# EAGLE design LED_Slave_Board (EAGLE 6.5.0)
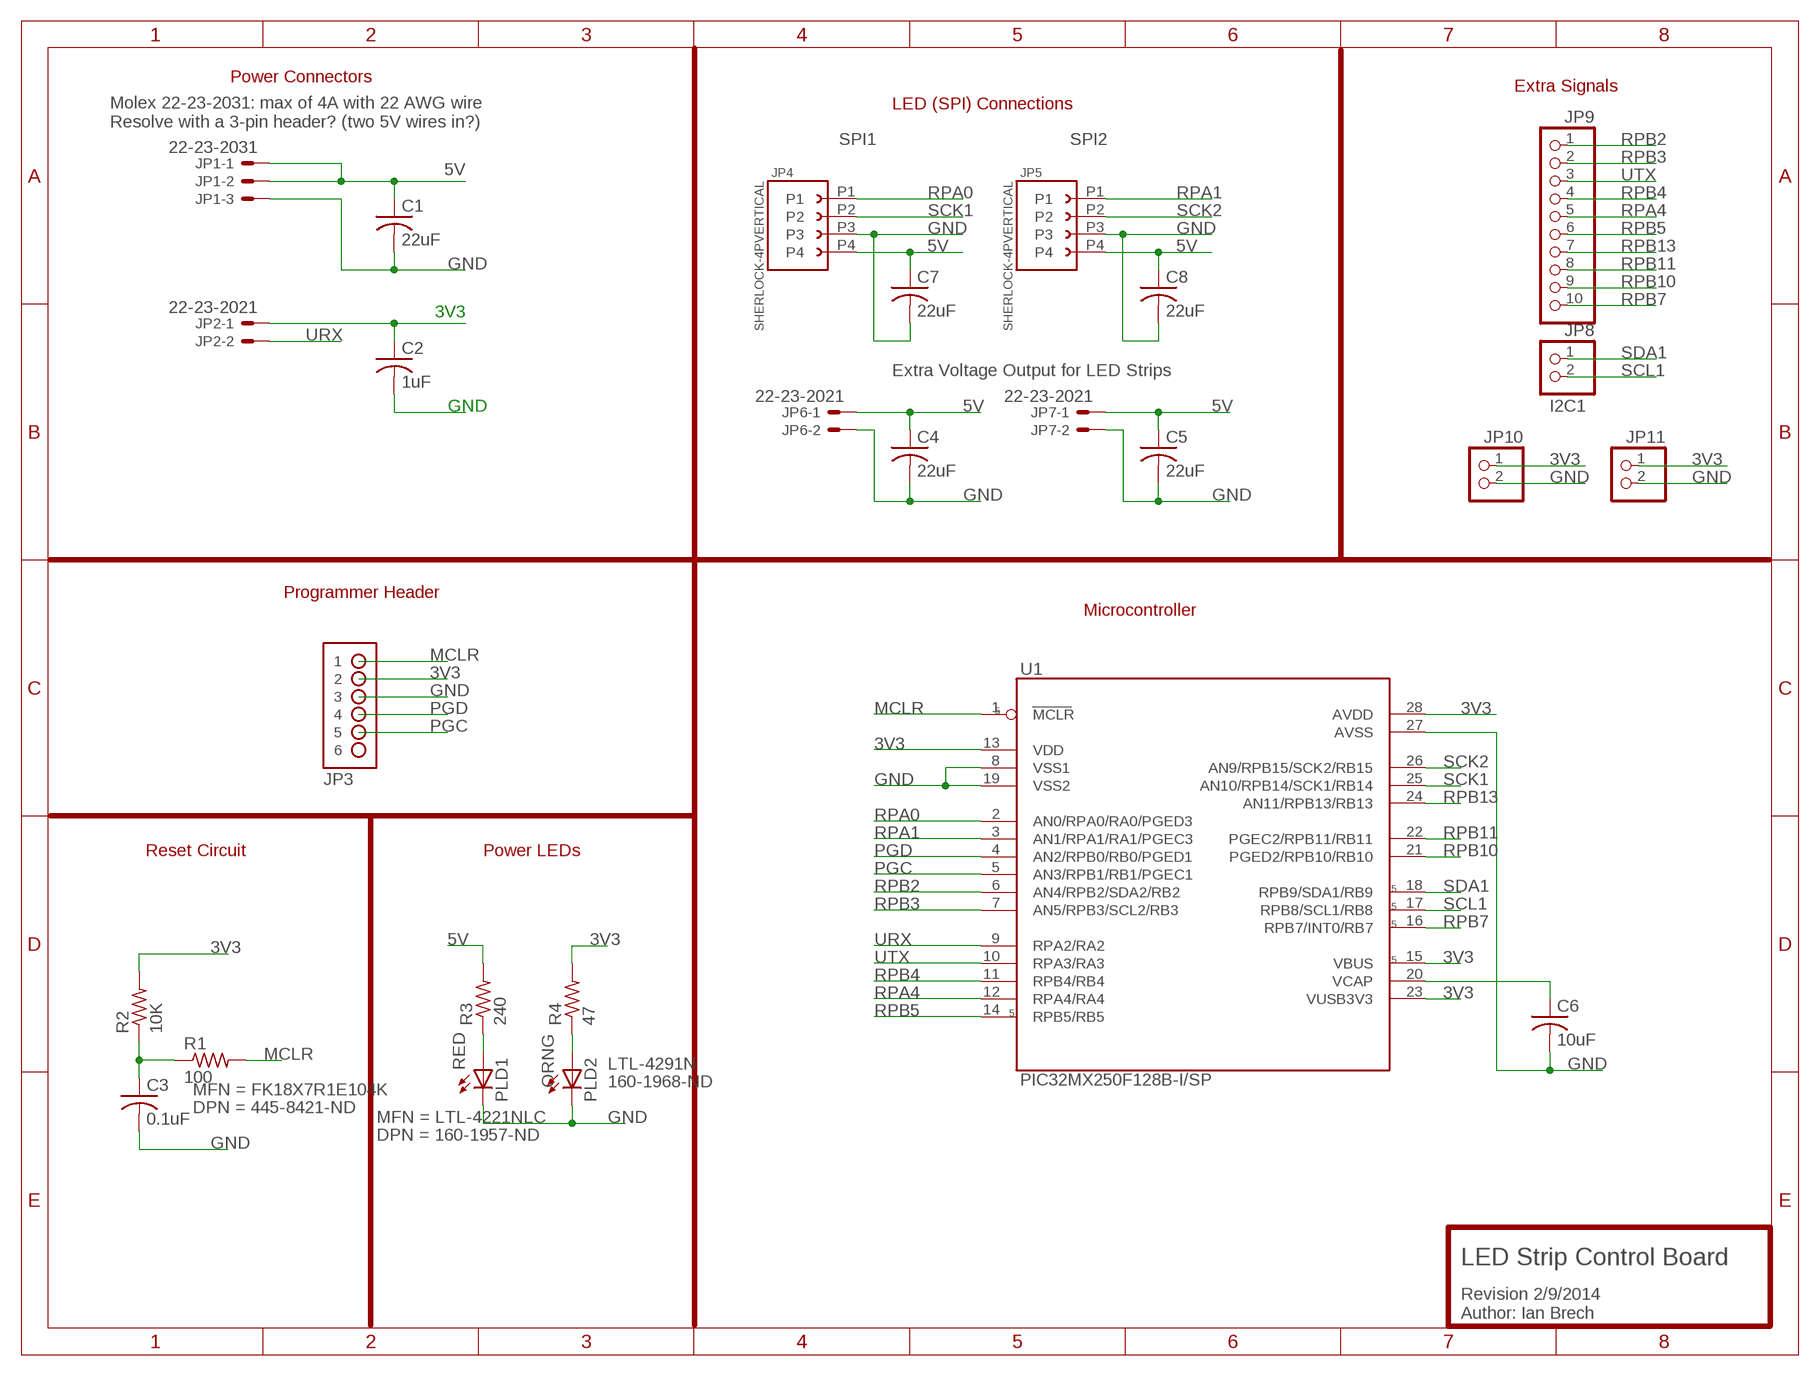
[diagram p0: schematic, sheet 1]

## Parts
C1  22uF  C-US050-045X075  [C050-045X075]
C2  1uF  C-US025-024X044  [C025-024X044]
C3  0.1uF  C-US025-040X050  [C025-040X050]
C4  22uF  C-US050-045X075  [C050-045X075]
C5  22uF  C-US050-045X075  [C050-045X075]
C6  10uF  C-US025-040X050  [C025-040X050]
C7  22uF  C-US050-045X075  [C050-045X075]
C8  22uF  C-US050-045X075  [C050-045X075]
JP1  22-23-2031  [22-23-2031]
JP2  22-23-2021  [22-23-2021]
JP3  HDR-1X6-OFFSET  [HDR-1X6_OFFSET]
JP4  SHERLOCK-4PVERTICAL  [35362-04**]
JP5  SHERLOCK-4PVERTICAL  [35362-04**]
JP6  22-23-2021  [22-23-2021]
JP7  22-23-2021  [22-23-2021]
JP8  PINHD-1X2  [1X02]
JP9  PINHD-1X10  [1X10]
JP10  PINHD-1X2  [1X02]
JP11  PINHD-1X2  [1X02]
PLD1  LED3MM  [LED3MM]
PLD2  LED3MM  [LED3MM]
R1  100  R-US_0204/7  [0204/7]
R2  10K  R-US_0204/7  [0204/7]
R3  240  R-US_0204/7  [0204/7]
R4  47  R-US_0204/7  [0204/7]
U1  PIC32MX250F128B-I/SP  [DIP254P762X508-28]

## Nets
3V3: C2.1 JP2.1 JP3.2 JP10.1 JP11.1 R2.2 R4.2 U1.13(VDD) U1.15(VBUS) U1.23(VUSB3V3) U1.28(AVDD)
5V: C1.1 C4.1 C5.1 C7.1 C8.1 JP1.1 JP1.2 JP4.P4 JP5.P4 JP6.1 JP7.1 R3.2
GND: C1.2 C2.2 C3.2 C4.2 C5.2 C6.2 C7.2 C8.2 JP1.3 JP3.3 JP4.P3 JP5.P3 JP6.2 JP7.2 JP10.2 JP11.2 PLD1.K(C) PLD2.K(C) U1.8(VSS1) U1.19(VSS2) U1.27(AVSS)
MCLR: JP3.1 R1.2 U1.1(MCLR)
N$1: PLD1.A R3.1
N$2: C3.1 R1.1 R2.1
N$3: PLD2.A R4.1
N$32: C6.1 U1.20(VCAP)
PGC: JP3.5 U1.5(AN3/RPB1/RB1/PGEC1)
PGD: JP3.4 U1.4(AN2/RPB0/RB0/PGED1)
RPA0: JP4.P1 U1.2(AN0/RPA0/RA0/PGED3)
RPA1: JP5.P1 U1.3(AN1/RPA1/RA1/PGEC3)
RPA4: JP9.5 U1.12(RPA4/RA4)
RPB2: JP9.1 U1.6(AN4/RPB2/SDA2/RB2)
RPB3: JP9.2 U1.7(AN5/RPB3/SCL2/RB3)
RPB4: JP9.4 U1.11(RPB4/RB4)
RPB5: JP9.6 U1.14(RPB5/RB5)
RPB7: JP9.10 U1.16(RPB7/INT0/RB7)
RPB10: JP9.9 U1.21(PGED2/RPB10/RB10)
RPB11: JP9.8 U1.22(PGEC2/RPB11/RB11)
RPB13: JP9.7 U1.24(AN11/RPB13/RB13)
SCK1: JP4.P2 U1.25(AN10/RPB14/SCK1/RB14)
SCK2: JP5.P2 U1.26(AN9/RPB15/SCK2/RB15)
SCL1: JP8.2 U1.17(RPB8/SCL1/RB8)
SDA1: JP8.1 U1.18(RPB9/SDA1/RB9)
URX: JP2.2 U1.9(RPA2/RA2)
UTX: JP9.3 U1.10(RPA3/RA3)
Unconnected: JP3.6

## Notes on the sheet
- Power Connectors
- Extra Signals
- LED (SPI) Connections
- Molex 22-23-2031: max of 4A with 22 AWG wire
  Resolve with a 3-pin header? (two 5V wires in?)
- SPI1 | SPI2
- Extra Voltage Output for LED Strips
- I2C1
- Programmer Header
- Microcontroller
- Reset Circuit | Power LEDs
- RED
- ORNG
- LED Strip Control Board
- Revision 2/9/2014
  Author: Ian Brech

## Library data of the parts
C1 C2 C4-C8 = rcl:C-US: CAPACITOR, American symbol
C3 = rcl:C-US: CAPACITOR, American symbol; DPN: 445-8421-ND; MFN: FK18X7R1E104K
JP1 = con-molex:22-23-2031: .100" (2.54mm) Center Header - 3 Pin; MF: MOLEX; MPN: 22-23-2031; OC_FARNELL: 1462950; OC_NEWARK: 30C0862
JP2 JP6 JP7 = con-molex:22-23-2021: .100" (2.54mm) Center Header - 2 Pin; MF: MOLEX; MPN: 22-23-2021; OC_FARNELL: 1462926; OC_NEWARK: 25C3832
JP3 = rs-extra-cons:HDR-1X6-OFFSET: 42 mil hole pattern with 16mil offset for jtag connector
JP4 JP5 = rs-molex-sherlock:SHERLOCK-4P: 4-pin Molex SherlockTM connector system Verticle 35362-04** Right Angle 35363-046** Mates with: 35507-0400 header 50212-8100 pins Use 63819-0500 crimper, and 57105-6000 pin extraction tool.
JP8 JP10 JP11 = pinhead:PINHD-1X2: PIN HEADER
JP9 = pinhead:PINHD-1X10: PIN HEADER
PLD1 = led:LED: LED OSRAM: - CHIPLED LG R971, LG N971, LY N971, LG Q971, LY Q971, LO R971, LY R971 LH N974, LH R974 LS Q976, LO Q976, LY Q976 LO Q996 - Hyper CHIPLED LW Q18S LB Q993, LB Q99A, LB R99A - SideLED LS A670, LO A670, LY A670, LG A670, LP A670 LB A673, LV A673, LT A673, LW A673 LH A674 LY A675 LS A676, LA A676, LO A676, LY A676, LW A676 LS A679, LY A679, LG A679 - Hyper Micro SIDELED® LS Y876, LA Y876, LO Y876, LY Y876 LT Y87S - SmartLED LW L88C, LW L88S LB L89C, LB L89S, LG L890 LS L89K, LO L89K, LY L89K LS L896, LA L896, LO L896, LY L896 - TOPLED LS T670, LO T670, LY T670, LG T670, LP T670 LSG T670, LSP T670, LSY T670, LOP T670, LYG T670 LG T671, LOG T671, LSG T671 LB T673, LV T673, LT T673, LW T673 LH T674 LS T676, LA T676, LO T676, LY T676, LB T676, LH T676, LSB T676, LW T676 LB T67C, LV T67C, LT T67C, LS T67K, LO T67K, LY T67K, LW E67C LS E67B, LA E67B, LO E67B, LY E67B, LB E67C, LV E67C, LT E67C LW T67C LS T679, LY T679, LG T679 LS T770, LO T770, LY T770, LG T770, LP T770 LB T773, LV T773, LT T773, LW T773 LH T774 LS E675, LA E675, LY E675, LS T675 LS T776, LA T776, LO T776, LY T776, LB T776 LHGB T686 LT T68C, LB T68C - Hyper Mini TOPLED® LB M676 - Mini TOPLED Santana® LG M470 LS M47K, LO M47K, LY M47K Source: http://www.osram.convergy.de LUXEON: - LUMILED® LXK2-PW12-R00, LXK2-PW12-S00, LXK2-PW14-U00, LXK2-PW14-V00 LXK2-PM12-R00, LXK2-PM12-S00, LXK2-PM14-U00 LXK2-PE12-Q00, LXK2-PE12-R00, LXK2-PE12-S00, LXK2-PE14-T00, LXK2-PE14-U00 LXK2-PB12-K00, LXK2-PB12-L00, LXK2-PB12-M00, LXK2-PB14-N00, LXK2-PB14-P00, LXK2-PB14-Q00 LXK2-PR12-L00, LXK2-PR12-M00, LXK2-PR14-Q00, LXK2-PR14-R00 LXK2-PD12-Q00, LXK2-PD12-R00, LXK2-PD12-S00 LXK2-PH12-R00, LXK2-PH12-S00 LXK2-PL12-P00, LXK2-PL12-Q00, LXK2-PL12-R00 Source: www.luxeon.com KINGBRIGHT: KA-3528ASYC Source: www.kingbright.com; DPN: 160-1957-ND; MFN: LTL-4221NLC
PLD2 = led:LED: LED OSRAM: - CHIPLED LG R971, LG N971, LY N971, LG Q971, LY Q971, LO R971, LY R971 LH N974, LH R974 LS Q976, LO Q976, LY Q976 LO Q996 - Hyper CHIPLED LW Q18S LB Q993, LB Q99A, LB R99A - SideLED LS A670, LO A670, LY A670, LG A670, LP A670 LB A673, LV A673, LT A673, LW A673 LH A674 LY A675 LS A676, LA A676, LO A676, LY A676, LW A676 LS A679, LY A679, LG A679 - Hyper Micro SIDELED® LS Y876, LA Y876, LO Y876, LY Y876 LT Y87S - SmartLED LW L88C, LW L88S LB L89C, LB L89S, LG L890 LS L89K, LO L89K, LY L89K LS L896, LA L896, LO L896, LY L896 - TOPLED LS T670, LO T670, LY T670, LG T670, LP T670 LSG T670, LSP T670, LSY T670, LOP T670, LYG T670 LG T671, LOG T671, LSG T671 LB T673, LV T673, LT T673, LW T673 LH T674 LS T676, LA T676, LO T676, LY T676, LB T676, LH T676, LSB T676, LW T676 LB T67C, LV T67C, LT T67C, LS T67K, LO T67K, LY T67K, LW E67C LS E67B, LA E67B, LO E67B, LY E67B, LB E67C, LV E67C, LT E67C LW T67C LS T679, LY T679, LG T679 LS T770, LO T770, LY T770, LG T770, LP T770 LB T773, LV T773, LT T773, LW T773 LH T774 LS E675, LA E675, LY E675, LS T675 LS T776, LA T776, LO T776, LY T776, LB T776 LHGB T686 LT T68C, LB T68C - Hyper Mini TOPLED® LB M676 - Mini TOPLED Santana® LG M470 LS M47K, LO M47K, LY M47K Source: http://www.osram.convergy.de LUXEON: - LUMILED® LXK2-PW12-R00, LXK2-PW12-S00, LXK2-PW14-U00, LXK2-PW14-V00 LXK2-PM12-R00, LXK2-PM12-S00, LXK2-PM14-U00 LXK2-PE12-Q00, LXK2-PE12-R00, LXK2-PE12-S00, LXK2-PE14-T00, LXK2-PE14-U00 LXK2-PB12-K00, LXK2-PB12-L00, LXK2-PB12-M00, LXK2-PB14-N00, LXK2-PB14-P00, LXK2-PB14-Q00 LXK2-PR12-L00, LXK2-PR12-M00, LXK2-PR14-Q00, LXK2-PR14-R00 LXK2-PD12-Q00, LXK2-PD12-R00, LXK2-PD12-S00 LXK2-PH12-R00, LXK2-PH12-S00 LXK2-PL12-P00, LXK2-PL12-Q00, LXK2-PL12-R00 Source: www.luxeon.com KINGBRIGHT: KA-3528ASYC Source: www.kingbright.com; DPN: 160-1968-ND; MFN: LTL-4291N
R1-R4 = rcl:R-US_: RESISTOR, American symbol
U1 = Microchip_By_element14_Batch_1:PIC32MX250F128B-I/SP

## Board
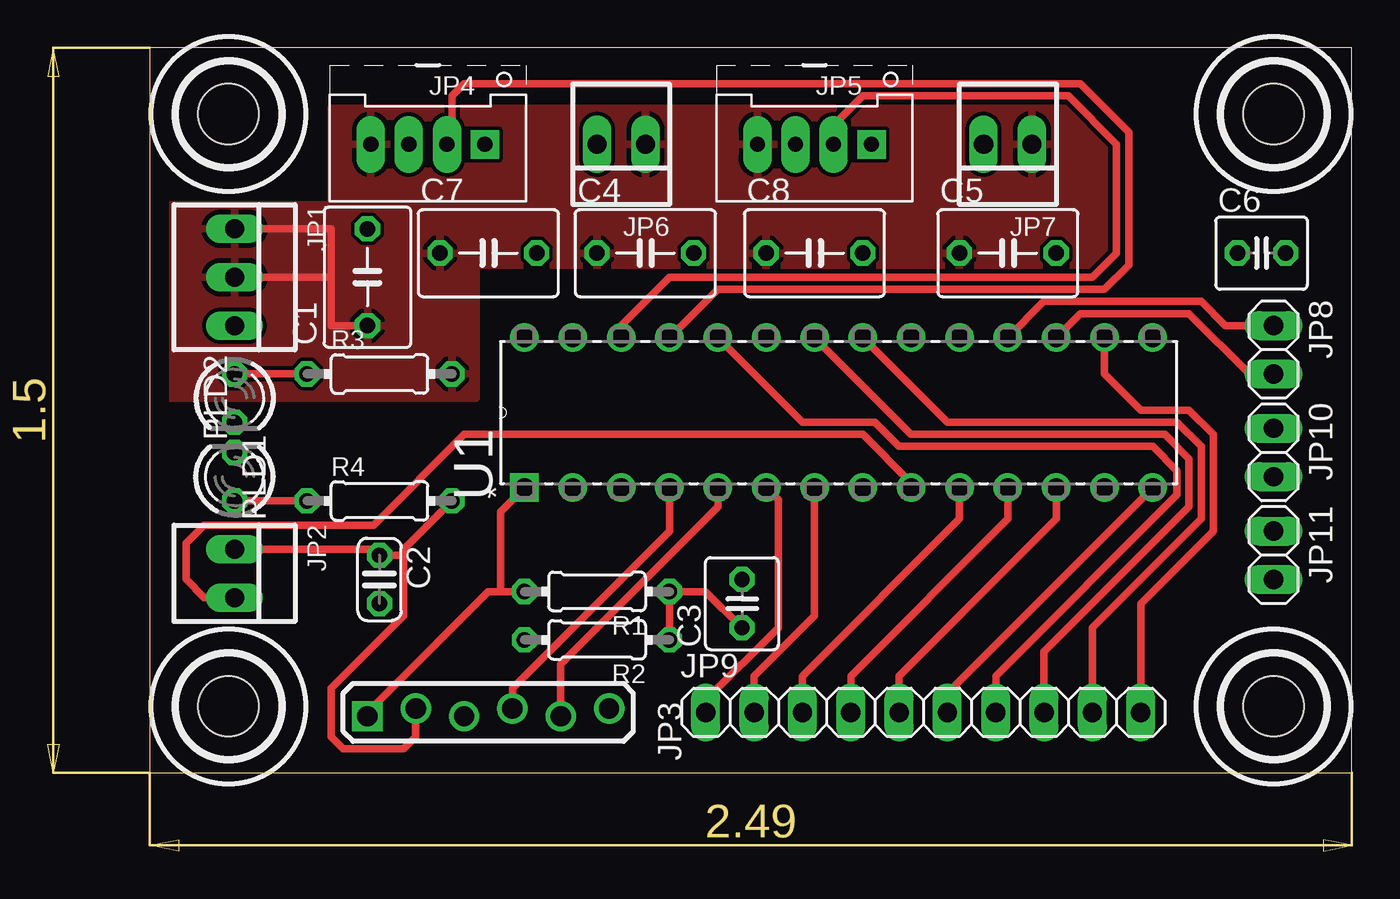
[diagram p1: board, top side]
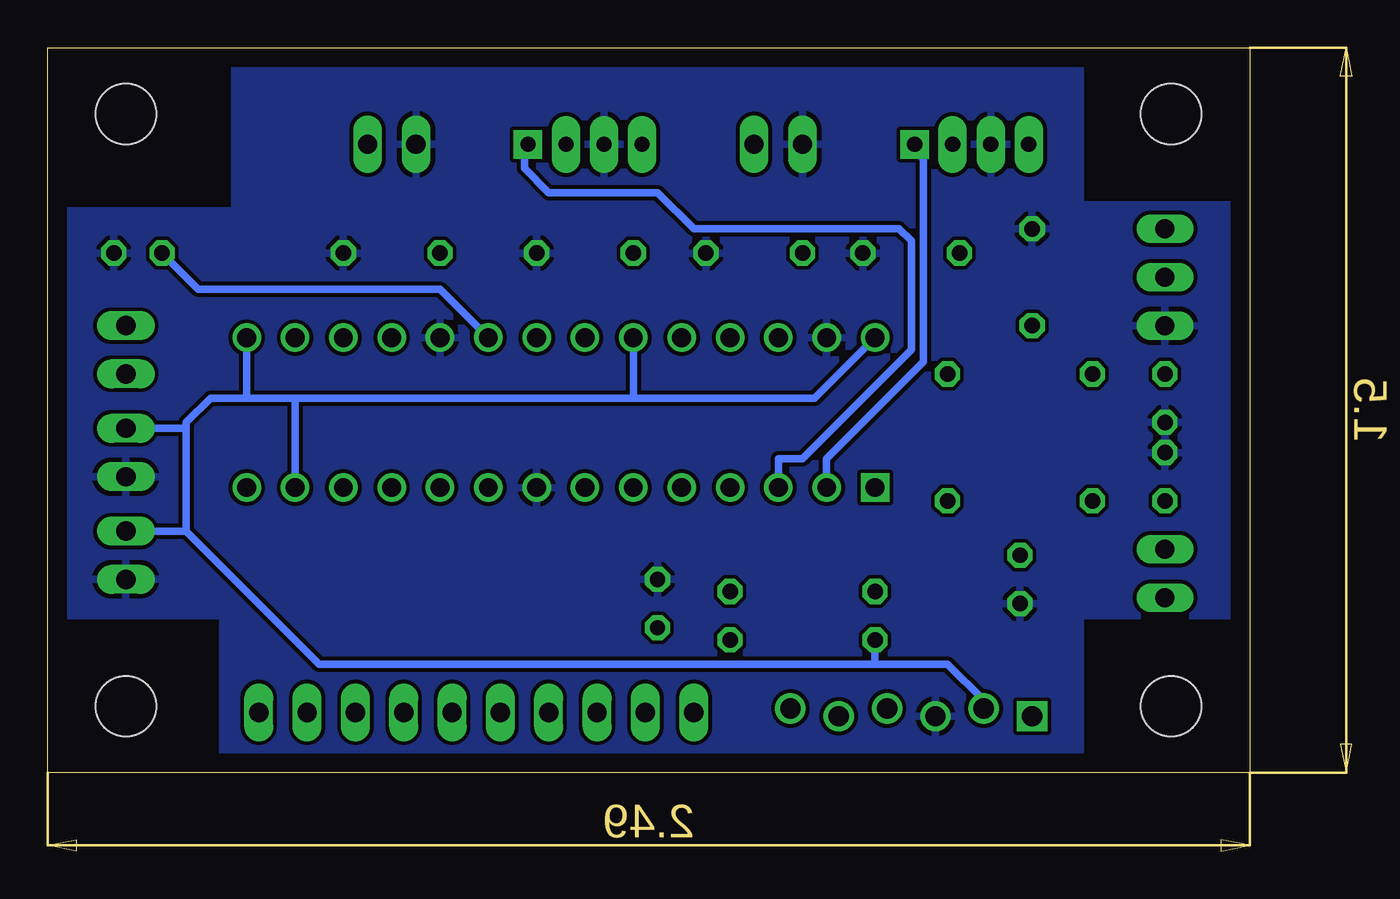
[diagram p2: board, bottom side, seen from below]

Size 63.17 x 38.09 mm. Coordinates in mm from the lower left corner, seen from the top.
Outline: 0,0 63.17,0 63.17,38.09 0,38.09 0,0
Copper layers (1*16): Top 0.035mm / dielectric 1.5mm / Bottom 0.035mm
Design rules "default": minimum track width 10mil, minimum drill 24mil, track to track 8mil, track to pad 8mil, pad to pad 8mil, via to via 8mil, smd to smd 8mil, copper to edge 40mil, drill to drill 8mil, minimum pad ring 10mil, minimum via ring 8mil, stop-mask expansion 4mil, vias tented up to drill 0mil, thermal gap 10mil
Holes 3.17 mm at 4.13,3.49 4.13,34.61 59.05,3.49 59.05,34.61

### Footprints (pad centres in the part's own frame; a part is rotated, then mirrored left to right if it is on the bottom)
C050-045X075 = drill 0.813 octagon: 1 -2.54,0; 2 2.54,0
C025-024X044 = drill 0.813 octagon: 1 -1.27,0; 2 1.27,0
C025-040X050 = drill 0.813 octagon: 1 -1.27,0; 2 1.27,0
22-23-2031 = drill 1 long: 1 -2.54,0; 2 0,0; 3 2.54,0
22-23-2021 = drill 1 long: 1 -1.27,0; 2 1.27,0
HDR-1X6_OFFSET = drill 1.067 square: 1 -0.203,6.35 | drill 1.067: 2 0.203,3.81; 3 -0.203,1.27; 4 0.203,-1.27; 5 -0.203,-3.81; 6 0.203,-6.35
35362-04** = drill 0.8 pad 1.5 square: P1 -3,0 | drill 0.8 pad 1.5 long: P2 -1,0; P3 1,0; P4 3,0
1X02 = drill 1.016 long: 1 -1.27,0; 2 1.27,0
1X10 = drill 1.016 long: 1 -11.43,0; 2 -8.89,0; 3 -6.35,0; 4 -3.81,0; 5 -1.27,0; 6 1.27,0; 7 3.81,0; 8 6.35,0; 9 8.89,0; 10 11.43,0
LED3MM = drill 0.813 octagon: A -1.27,0; K 1.27,0
0204/7 = drill 0.813 octagon: 1 -3.81,0; 2 3.81,0
DIP254P762X508-28 = drill 0.991 square: 1 -7.874,33.02 | drill 0.991: 2 -7.874,30.48; 3 -7.874,27.94; 4 -7.874,25.4; 5 -7.874,22.86; 6 -7.874,20.32; 7 -7.874,17.78; 8 -7.874,15.24; 9 -7.874,12.7; 10 -7.874,10.16; 11 -7.874,7.62; 12 -7.874,5.08; 13 -7.874,2.54; 14 -7.874,0; 15 0,0; 16 0,2.54; 17 0,5.08; 18 0,7.62; 19 0,10.16; 20 0,12.7; 21 0,15.24; 22 0,17.78; 23 0,20.32; 24 0,22.86; 25 0,25.4; 26 0,27.94; 27 0,30.48; 28 0,33.02

### Placement (x,y rotation side)
C1  11.43,26.04 90 top
C2  12.06,10.16 270 top
C3  31.11,8.89 90 top
C4  26.04,27.3 0 top
C5  45.09,27.3 0 top
C6  58.42,27.3 0 top
C7  17.78,27.3 0 top
C8  34.92,27.3 0 top
JP1  4.45,26.04 270 top
JP2  4.45,10.48 270 top
JP3  17.78,3.17 90 top
JP4  14.61,33.02 180 top
JP5  34.92,33.02 180 top
JP6  24.77,33.02 180 top
JP7  45.09,33.02 180 top
JP8  59.05,22.23 270 top
JP9  40.64,3.17 0 top
JP10  59.05,16.83 270 top
JP11  59.05,11.43 270 top
PLD1  4.45,19.68 270 top
PLD2  4.45,15.56 90 top
R1  23.5,9.53 180 top
R2  23.5,6.99 180 top
R3  12.06,20.95 0 top
R4  12.06,14.29 0 top
U1  52.7,22.86 90 top

### Tracks (layer width: path | path; a pad name or v marks a point on that pad's centre or on a via)
3V3
  Top 0.406: JP3.2 13.97,1.91 13.34,1.27 10.16,1.27 9.53,1.91 9.53,4.45 13.34,8.26 13.34,11.43 | 13.34,11.43 C2.1 11.75,11.75 JP2.1 | 13.34,11.43 13.34,11.75 R4.2
  Bottom 0.406: 32.38,19.68 22.86,19.68 U1.28 | 32.38,19.68 50.16,19.68 | 50.16,19.68 52.7,19.68 | 52.7,19.68 54.61,19.68 55.88,18.41 55.88,18.1 | 55.88,12.7 55.88,18.1 | JP3.2 13.97,3.81 15.88,5.71 19.68,5.71 | 19.68,5.71 48.9,5.71 55.88,12.7 | 32.38,19.68 U1.23 | U1.15 52.7,19.68 | U1.13 50.16,19.68 | JP11.1 55.88,12.7 | R2.2 19.68,5.71 | JP10.1 55.88,18.1
5V
  Top 0.406: JP1.2 9.53,26.04 | 9.53,26.04 9.53,23.5 C1.1 | JP1.1 9.53,28.57 9.53,26.04
  pour Top: 0.64,29.84 9.53,29.84 9.53,34.92 50.16,34.92 50.16,26.67 17.14,26.67 17.14,19.68 0.64,19.68
GND
  pour Bottom: 0,29.84 8.89,29.84 8.89,38.1 53.34,38.1 53.34,29.53 63.5,29.53 63.5,8.26 53.98,8.26 53.98,0 8.89,0 8.89,8.26 0,8.26
MCLR
  Top 0.406: 18.41,9.53 18.41,13.72 U1.1 | R1.2 18.41,9.53 | JP3.1 11.43,3.17 17.78,9.53 18.41,9.53
N$1
  Top 0.406: PLD1.A R3.1
N$2
  Top 0.406: R2.1 R1.1 29.21,9.53 C3.1
N$3
  Top 0.406: PLD2.A R4.1
N$32
  Bottom 0.406: U1.20 42.55,25.4 55.24,25.4 C6.1
PGC
  Top 0.406: JP3.5 21.59,5.71 29.84,13.97 U1.5
PGD
  Top 0.406: JP3.4 19.05,4.45 27.3,12.7 U1.4
RPA0
  Bottom 0.406: JP4.P1 17.14,32.21 17.14,21.59 22.23,16.51 U1.2
RPA1
  Bottom 0.406: U1.3 24.77,16.51 23.5,16.51 17.78,22.23 17.78,27.94 18.41,28.57 29.21,28.57 31.11,30.48 36.83,30.48 38.1,31.75 38.1,32.84 JP5.P1
RPA4
  Top 0.406: JP9.5 39.37,5.08 47.62,13.34 U1.12
RPB2
  Top 0.406: JP9.1 29.21,3.81 33.02,7.62 33.02,14.35 U1.6
RPB3
  Top 0.406: JP9.2 31.75,5.08 34.92,8.26 U1.7
RPB4
  Top 0.406: JP9.4 36.83,5.08 45.09,13.34 U1.11
RPB5
  Top 0.406: JP9.6 41.91,4.19 U1.14
RPB7
  Top 0.406: U1.16 50.16,20.95 52.07,19.05 54.61,19.05 55.88,17.78 55.88,12.7 52.07,8.89 JP9.10
RPB10
  Top 0.406: U1.21 41.91,18.41 53.98,18.41 55.24,17.14 55.24,13.34 49.53,7.62 JP9.9
RPB11
  Top 0.406: U1.22 40.01,17.78 53.34,17.78 54.61,16.51 54.61,13.97 46.99,6.35 JP9.8
RPB13
  Top 0.406: JP9.7 44.45,5.08 53.98,14.61 53.98,15.88 52.7,17.14 39.37,17.14 38.1,18.41 34.29,18.41 U1.24
SCK1
  Top 0.406: JP4.P2 15.88,33.29 15.88,35.56 16.51,36.2 48.9,36.2 51.44,33.66 51.44,26.67 50.16,25.4 29.84,25.4 U1.25
SCK2
  Top 0.406: JP5.P2 36.2,33.29 36.2,34.29 37.47,35.56 48.26,35.56 50.8,33.02 50.8,27.3 49.53,26.04 27.3,26.04 24.77,23.5 U1.26
SCL1
  Top 0.406: JP8.2 57.78,20.95 54.61,24.13 48.9,24.13 U1.17
SDA1
  Top 0.406: JP8.1 56.52,23.5 55.24,24.77 46.99,24.77 U1.18
URX
  Top 0.254: 40.01,15.24 U1.9
  Top 0.406: 40.01,15.24 37.47,17.78 16.51,17.78 11.75,13.02 2.86,13.02 1.91,12.06 1.91,10.16 2.86,9.21 JP2.2
UTX
  Top 0.406: JP9.3 34.29,5.08 42.55,13.34 U1.10